# EAGLE schematic experiment double buffer grounded (EAGLE 9.6.2)
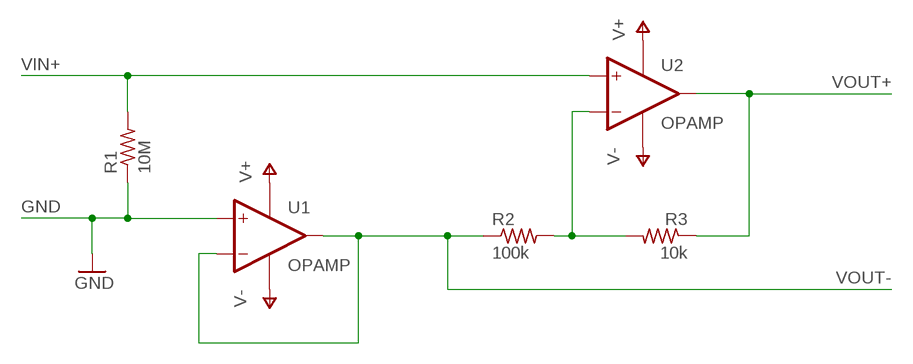
[diagram p0: schematic, sheet 1]

## Parts
R1  10M  R-US_R0805  [R0805]
R2  100k  R-US_R0805  [R0805]
R3  10k  R-US_R0805  [R0805]
U1  OPAMP  (no package)
U2  OPAMP  (no package)

## Nets
GND: R1.1 U1.+IN
N$3: R2.2 R3.2 U2.-IN
V+: U1.V+ U2.V+
V-: U1.V- U2.V-
VIN+: R1.2 U2.+IN
VOUT+: R3.1 U2.OUT
VOUT-: R2.1 U1.-IN U1.OUT

## Library data of the parts
R1-R3 = rcl:R-US_: RESISTOR, American symbol; SPICEPREFIX: R
U1 U2 = Generic:OPAMP: Generic OpAmp device with supply rails connected